# EAGLE schematic SparkFun_Artemis_OpenLog (EAGLE 9.6.0)
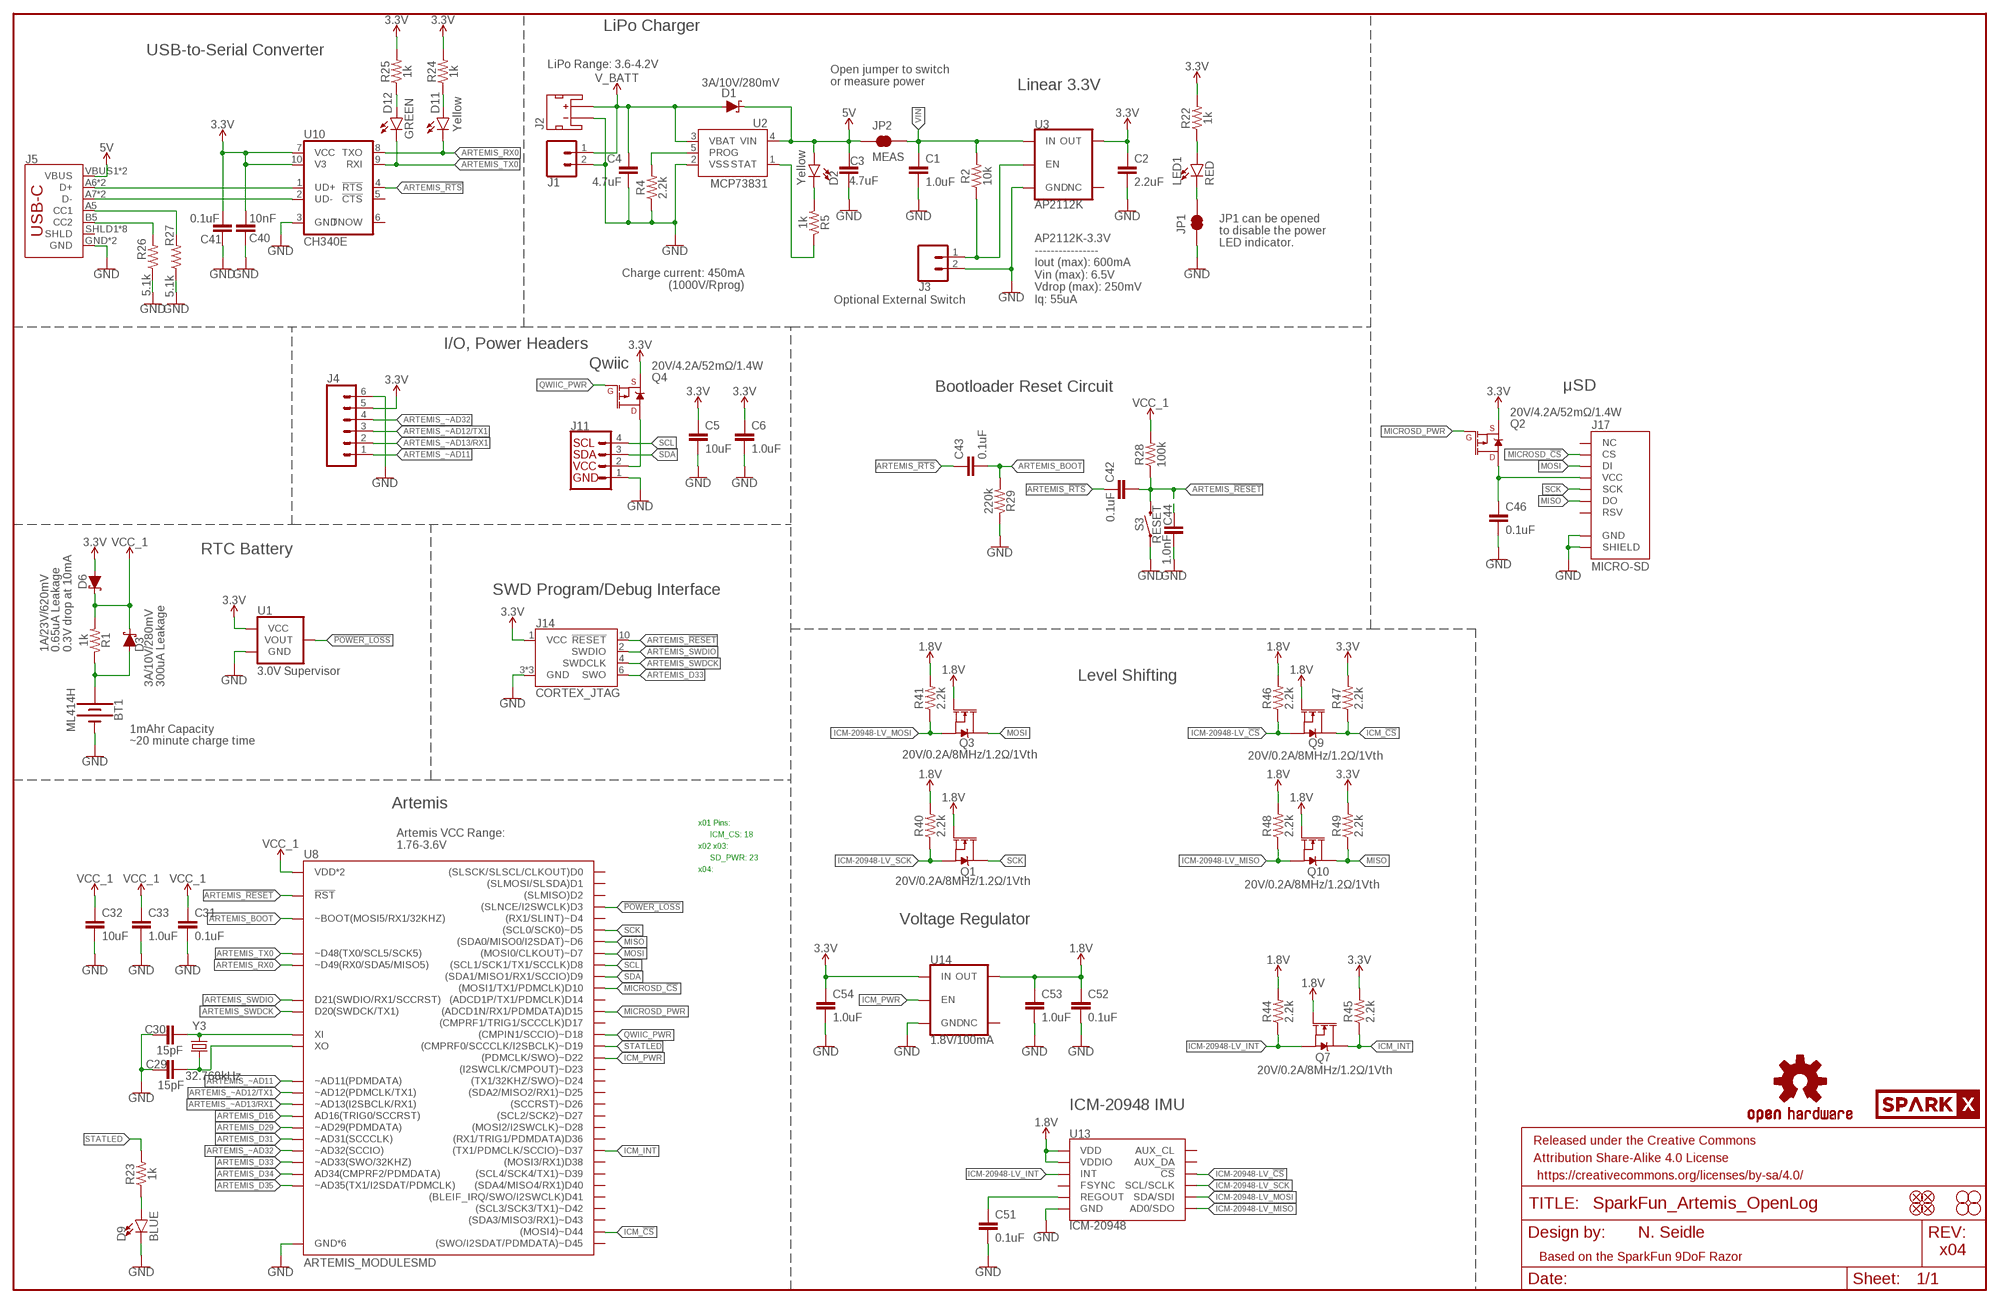
[diagram p0: schematic, sheet 1]

## Parts
BT1  ML414H  ML414H_IV01E_BATTERY  [ML414H_IV01E]
C1  1.0uF  1.0UF-0603-16V-10%  [0603]
C2  2.2uF  2.2UF-0603-10V-20%  [0603]
C3  4.7uF  4.7UF-0402_TIGHT-6.3V-20%-X5R  [0402-TIGHT]
C4  4.7uF  4.7UF-0402_TIGHT-6.3V-20%-X5R  [0402-TIGHT]
C5  10uF  10UF-0603-6.3V-20%  [0603]
C6  1.0uF  1.0UF-0402T-16V-10%  [0402-TIGHT]
C29  15pF  15PF-0402T-50V-5%  [0402-TIGHT]
C30  15pF  15PF-0402T-50V-5%  [0402-TIGHT]
C31  0.1uF  0.1UF-0402T-16V-10%  [0402-TIGHT]
C32  10uF  10UF-0603-6.3V-20%  [0603]
C33  1.0uF  1.0UF-0402T-16V-10%  [0402-TIGHT]
C40  10nF  10NF-0603-50V-10%  [0603]
C41  0.1uF  0.1UF-0402T-16V-10%  [0402-TIGHT]
C42  0.1uF  0.1UF-0402T-16V-10%  [0402-TIGHT]
C43  0.1uF  0.1UF-0402T-16V-10%  [0402-TIGHT]
C44  1.0nF  1.0NF/1000PF-0402_TIGHT-50V-10%  [0402-TIGHT]
C46  0.1uF  0.1UF-0402T-16V-10%  [0402-TIGHT]
C51  0.1uF  0.1UF-0402T-16V-10%  [0402-TIGHT]
C52  0.1uF  0.1UF-0402T-16V-10%  [0402-TIGHT]
C53  1.0uF  1.0UF-0402T-16V-10%  [0402-TIGHT]
C54  1.0uF  1.0UF-0402T-16V-10%  [0402-TIGHT]
D1  3A/10V/280mV  DIODE-SCHOTTKY-BAT60A  [SOD-323]
D2  Yellow  LED-YELLOW0603  [LED-0603]
D3  3A/10V/280mV  DIODE-SCHOTTKY-BAT60A  [SOD-323]
D6  1A/23V/620mV  DIODE-SCHOTTKY-BAT20J  [SOD-323]
D9  BLUE  LED-BLUE0603  [LED-0603]
D11  Yellow  LED-YELLOW0603  [LED-0603]
D12  GREEN  LED-GREEN0603  [LED-0603]
FD1  FIDUCIAL1X2  [FIDUCIAL-1X2]
FD2  FIDUCIAL1X2  [FIDUCIAL-1X2]
FD3  FIDUCIAL1X2  [FIDUCIAL-1X2]
FD4  FIDUCIAL1X2  [FIDUCIAL-1X2]
FRAME1  FRAME-LEDGER  [CREATIVE_COMMONS]
H1  STAND-OFF  [STAND-OFF]
H2  STAND-OFF  [STAND-OFF]
H3  STAND-OFF  [STAND-OFF]
H4  STAND-OFF  [STAND-OFF]
J1  CONN_021X02_NO_SILK  [1X02_NO_SILK]
J2  JST_2MM_MALE  [JST-2-SMD]
J3  CONN_021X02_NO_SILK  [1X02_NO_SILK]
J4  CONN_06NO_SILK_NO_POP  [1X06_NO_SILK]
J5  USB_C5  [USB-C-16P-5]
J11  QWIIC_CONNECTORJS-1MM  [JST04_1MM_RA]
J14  CORTEX_JTAG  CORTEX_JTAG_DEBUG_MINIMUM_PTH  [2X5-PTH-1.27MM]
J17  MICRO-SD  MICRO-SD_CARD_SOCKETPUSH-PUSH  [MICRO-SD-SOCKET]
JP1  JUMPER-SMT_2_NC_TRACE_SILK  [SMT-JUMPER_2_NC_TRACE_SILK]
JP2  MEAS  JUMPER-COMBO_2_NC_TRACE  [COMBO-JUMPER_2_NC_TRACE]
LED1  RED  LED-RED0603  [LED-0603]
LOGO2  OSHW-LOGOS  [OSHW-LOGO-S]
Q1  20V/0.2A/8MHz/1.2Ω/1Vth  MOSFET-NCH-RE1C00UNTL  [SOT-416FL]
Q2  20V/4.2A/52mΩ/1.4W  MOSFET_PCH-DMG2305UX-7  [SOT23-3]
Q3  20V/0.2A/8MHz/1.2Ω/1Vth  MOSFET-NCH-RE1C00UNTL  [SOT-416FL]
Q4  20V/4.2A/52mΩ/1.4W  MOSFET_PCH-DMG2305UX-7  [SOT23-3]
Q7  20V/0.2A/8MHz/1.2Ω/1Vth  MOSFET-NCH-RE1C00UNTL  [SOT-416FL]
Q9  20V/0.2A/8MHz/1.2Ω/1Vth  MOSFET-NCH-RE1C00UNTL  [SOT-416FL]
Q10  20V/0.2A/8MHz/1.2Ω/1Vth  MOSFET-NCH-RE1C00UNTL  [SOT-416FL]
R1  1k  1KOHM-0402T-1/16W-1%  [0402-TIGHT]
R2  10k  10KOHM-0402T-1/16W-1%  [0402-TIGHT]
R4  2.2k  2.2KOHM-0402T-1/16W-1%  [0402-TIGHT]
R5  1k  1KOHM-0402T-1/16W-1%  [0402-TIGHT]
R22  1k  1KOHM-0402T-1/16W-1%  [0402-TIGHT]
R23  1k  1KOHM-0402T-1/16W-1%  [0402-TIGHT]
R24  1k  1KOHM-0402T-1/16W-1%  [0402-TIGHT]
R25  1k  1KOHM-0402T-1/16W-1%  [0402-TIGHT]
R26  5.1k  5.1KOHM-0402T-1/16W-1%  [0402-TIGHT]
R27  5.1k  5.1KOHM-0402T-1/16W-1%  [0402-TIGHT]
R28  100k  100KOHM-0402T-1/16W-1%  [0402-TIGHT]
R29  220k  220KOHM-0603-1/10W-1%  [0603]
R40  2.2k  2.2KOHM-0402T-1/16W-1%  [0402-TIGHT]
R41  2.2k  2.2KOHM-0402T-1/16W-1%  [0402-TIGHT]
R44  2.2k  2.2KOHM-0402T-1/16W-1%  [0402-TIGHT]
R45  2.2k  2.2KOHM-0402T-1/16W-1%  [0402-TIGHT]
R46  2.2k  2.2KOHM-0402T-1/16W-1%  [0402-TIGHT]
R47  2.2k  2.2KOHM-0402T-1/16W-1%  [0402-TIGHT]
R48  2.2k  2.2KOHM-0402T-1/16W-1%  [0402-TIGHT]
R49  2.2k  2.2KOHM-0402T-1/16W-1%  [0402-TIGHT]
S3  RESET  MOMENTARY-SWITCH-SPST-SMD-4.6X2.8MM  [TACTILE_SWITCH_SMD_4.6X2.8MM]
U1  3.0V Supervisor  V_SUPERVISOR  [SOT23-3]
U2  MCP73831  [SOT23-5]
U3  AP2112K  V_REG_AP2112K-3.3V  [SOT23-5]
U8  ARTEMIS_MODULESMD  [ARTEMIS_FP]
U10  CH340E  CH340E_MSOP10  [MSOP10]
U13  ICM-20948  [QFN24-3X3]
U14  1.8V/100mA  V_REG_SP6214-1.8V  [SC70]
U$6  SPARKX-LOGO3  [SPARKX-SMALL]
Y3  32.768kHz  CRYSTAL-32.768KHZSMD-3.2X1.5  [CRYSTAL-SMD-3.2X1.5MM]

## Nets
3.3V: C2.1 C5.1 C6.1 C40.1 C41.1 C54.1 D6.A J4.5 J14.1(VCC) Q2.2(S) Q4.2(S) R22.2 R24.2 R25.2 R45.2 R47.2 R49.2 U1.3(VCC) U3.5(OUT) U10.7(VCC) U10.10(V3) U14.1(IN)
5V: C3.1 D1.C D2.A J5.VBUS1(VBUS) J5.VBUS2(VBUS) JP2.1 JP2.3 U2.4(VIN)
!POWER_LOSS!: U1.2(VOUT) U8.D3((SLNCE/I2SWCLK)D3)
ARTEMIS_!RESET: C42.2 C44.1 J14.10(!RESET) R28.1 S3.3 S3.4 U8.~RST(!RST)
ARTEMIS_!RTS!: C42.1 C43.1 U10.4(!RTS)
ARTEMIS_BOOT: C43.2 R29.2 U8.BOOT(~BOOT(MOSI5/RX1/32KHZ))
ARTEMIS_D16: U8.AD16(AD16(TRIG0/SCCRST))
ARTEMIS_D29: U8.~AD29(~AD29(PDMDATA))
ARTEMIS_D31: U8.~AD31(~AD31(SCCCLK))
ARTEMIS_D33: J14.6(SWO) U8.~AD33/SWO(~AD33(SWO/32KHZ))
ARTEMIS_D34: U8.AD34(AD34(CMPRF2/PDMDATA))
ARTEMIS_D35: U8.~AD35(~AD35(TX1/I2SDAT/PDMCLK))
ARTEMIS_RX0: D11.C U8.RXI-0(~D49(RX0/SDA5/MISO5)) U10.8(TXO)
ARTEMIS_SWDCK: J14.4(SWDCLK) U8.SWDCK(D20(SWDCK/TX1))
ARTEMIS_SWDIO: J14.2(SWDIO) U8.SWDIO(D21(SWDIO/RX1/SCCRST))
ARTEMIS_TX0: D12.C U8.TXO-0(~D48(TX0/SCL5/SCK5)) U10.9(RXI)
ARTEMIS_~AD11: J4.1 U8.~AD11(~AD11(PDMDATA))
ARTEMIS_~AD12/TX1: J4.3 U8.~AD12(~AD12(PDMCLK/TX1))
ARTEMIS_~AD13/RX1: J4.2 U8.~AD13(~AD13(I2SBCLK/RX1))
ARTEMIS_~AD32: J4.4 U8.~AD32(~AD32(SCCIO))
CC3: J5.B5(CC2) R26.2
CC4: J5.A5(CC1) R27.2
CHG_LED: R5.1 U2.1(STAT)
D+2: J5.A6(D+) J5.B6(D+) U10.1(UD+)
D-2: J5.A7(D-) J5.B7(D-) U10.2(UD-)
GND: BT1.- C1.2 C2.2 C3.2 C4.2 C5.2 C6.2 C29.1 C30.1 C31.1 C32.2 C33.2 C40.2 C41.2 C44.2 C46.2 C51.2 C52.2 C53.2 C54.2 D9.C J1.2 J2.1(-) J3.2 J4.6 J5.GND J5.GND2(GND) J11.1 J14.3(GND) J14.5(GND) J14.9(GND) J17.CD1(SHIELD) J17.GND JP1.1 R4.1 R26.1 R27.1 R29.1 S3.1 S3.2 U1.1(GND) U2.2(VSS) U3.2(GND) U8.GND@1(GND*6) U8.GND@22(GND*6) U8.GND@38(GND*6) U8.GND@39(GND*6) U8.GND@47(GND*6) U8.GND@59(GND*6) U10.3(GND) U13.18(GND) U13.20(GND) U14.2(GND)
ICM-20948-LV_!CS!: Q9.2(S) R46.1 U13.22(!CS)
ICM-20948-LV_#_1.8V: C52.1 C53.1 Q1.1(G) Q3.1(G) Q7.1(G) Q9.1(G) Q10.1(G) R40.2 R41.2 R44.2 R46.2 R48.2 U13.8(VDDIO) U13.13(VDD) U14.5(OUT) ; supply symbol labelled 1.8V
ICM-20948-LV_INT: Q7.2(S) R44.1 U13.12(INT)
ICM-20948-LV_MISO: Q10.2(S) R48.1 U13.9(AD0/SDO)
ICM-20948-LV_MOSI: Q3.2(S) R41.1 U13.24(SDA/SDI)
ICM-20948-LV_SCK: Q1.2(S) R40.1 U13.23(SCL/SCLK)
ICM_!CS!: Q9.3(D) R47.1 U8.~D44((MOSI4)~D44)
ICM_INT: Q7.3(D) R45.1 U8.~D37((TX1/PDMCLK/SCCIO)~D37)
ICM_PWR: U8.~D22((PDMCLK/SWO)~D22) U14.3(EN)
MICROSD_!CS!: J17.CS U8.D10((MOSI1/TX1/PDMCLK)D10)
MICROSD_PWR: Q2.1(G) U8.D15((ADCD1N/RX1/PDMDATA)D15)
MISO: J17.DO Q10.3(D) R49.1 U8.~D6((SDA0/MISO0/I2SDAT)~D6)
MOSI: J17.DI Q3.3(D) U8.D7((MOSI0/CLKOUT)~D7)
N$1: BT1.+ D3.A R1.1
N$4: JP1.2 LED1.C
N$5: J11.2 Q4.3(D)
N$7: R4.2 U2.5(PROG)
N$11: D2.C R5.2
N$20: C29.2 U8.XO Y3.P$2
N$21: C30.2 U8.XI Y3.P$1
N$24: LED1.A R22.1
N$25: D9.A R23.1
N$26: D12.A R25.1
N$27: D11.A R24.1
N$30: C51.1 U13.10(REGOUT)
QWIIC_PWR: Q4.1(G) U8.~D18((CMPIN1/SCCIO)~D18)
SCK: J17.SCLK(SCK) Q1.3(D) U8.~D5((SCL0/SCK0)~D5)
SCL: J11.4 U8.D8((SCL1/SCK1/TX1/SCCLK)D8)
SD_PWR: C46.1 J17.VCC Q2.3(D)
SDA: J11.3 U8.D9((SDA1/MISO1/RX1/SCCIO)D9)
STATLED: R23.2 U8.~D19((CMPRF0/SCCCLK/I2SBCLK)~D19)
V_BATT: C4.1 D1.A J1.1 J2.2(+) U2.3(VBAT)
VCC_1: C31.2 C32.1 C33.1 D3.C D6.C R1.2 R28.2 U8.VDD@36(VDD*2) U8.VDD@37(VDD*2)
VIN: C1.1 JP2.2 JP2.4 R2.2 U3.1(IN)
VREG_EN: J3.1 R2.1 U3.3(EN)
Unconnected: J2.NC1(PAD1) J2.NC2(PAD2) J5.SHLD1(SHLD) J5.SHLD2(SHLD) J5.SHLD3(SHLD) J5.SHLD4(SHLD) J5.SHLD5(SHLD) J5.SHLD6(SHLD) J5.SHLD7(SHLD) J5.SHLD8(SHLD) J17.RSV1(RSV) J17.RSV2(NC) U3.4(NC) U8.D0((SLSCK/SLSCL/CLKOUT)D0) U8.D1((SLMOSI/SLSDA)D1) U8.D2((SLMISO)D2) U8.D14((ADCD1P/TX1/PDMCLK)D14) U8.D17((CMPRF1/TRIG1/SCCCLK)D17) U8.D36((RX1/TRIG1/PDMDATA)D36) U8.D38((MOSI3/RX1)D38) U8.D40((SDA4/MISO4/RX1)D40) U8.D41((BLEIF_IRQ/SWO/I2SWCLK)D41) U8.~D4((RX1/SLINT)~D4) U8.~D23((I2SWCLK/CMPOUT)~D23) U8.~D24((TX1/32KHZ/SWO)~D24) U8.~D25((SDA2/MISO2/RX1)~D25) U8.~D26((SCCRST)~D26) U8.~D27((SCL2/SCK2)~D27) U8.~D28((MOSI2/I2SWCLK)~D28) U8.~D39((SCL4/SCK4/TX1)~D39) U8.~D42((SCL3/SCK3/TX1)~D42) U8.~D43((SDA3/MISO3/RX1)~D43) U8.~D45((SWO/I2SDAT/PDMDATA)~D45) U10.5(!CTS) U10.6(TNOW) U13.7(AUX_CL) U13.11(FSYNC) U13.21(AUX_DA) U14.4(NC)

## Notes on the sheet
- LiPo Charger
- USB-to-Serial Converter
- LiPo Range: 3.6-4.2V
- Linear 3.3V
- Open jumper to switch
  or measure power
- JP1 can be opened
  to disable the power
  LED indicator.
- AP2112K-3.3V
  ----------------
  Iout (max): 600mA 
  Vin (max): 6.5V
  Vdrop (max): 250mV
  Iq: 55uA
- Charge current: 450mA
  (1000V/Rprog)
- Optional External Switch
- I/O, Power Headers
- Qwiic
- Bootloader Reset Circuit | μSD
- RTC Battery
- SWD Program/Debug Interface
- 0.65uA Leakage
  0.3V drop at 10mA
- Level Shifting
- 300uA Leakage
- 1mAhr Capacity
- ~20 minute charge time
- Artemis
- x01 Pins:
- ICM_CS: 18
- Artemis VCC Range:
  1.76-3.6V
- x02 x03:
- SD_PWR: 23
- x04:
- Voltage Regulator
- ICM-20948 IMU
- N. Seidle
- x04
- Based on the SparkFun 9DoF Razor

## Library data of the parts
BT1 = SparkFun-Batteries:ML414H_IV01E_BATTERY: SEIKO ML414H-IV01E Reflowable Lithium Battery ML414H is a rechargeable, coin type battery with features such as Pb-free reflowable (Peak temperature: 260 C) and high temperature heat resistance. Battery Characteristics: 3.1V max voltage Voff is 2V 1mAH 3k series resistor with battery 72 hour charge time from 2.0-3.1V 2.3-2.8V initial charge; PROD_ID: BATT-14267
C1 = SparkFun-Capacitors:1.0UF: 1µF ceramic capacitors A capacitor is a passive two-terminal electrical component used to store electrical energy temporarily in an electric field.; PROD_ID: CAP-00868
C2 = SparkFun-Capacitors:2.2UF: 2.2µF ceramic capacitors A capacitor is a passive two-terminal electrical component used to store electrical energy temporarily in an electric field.; PROD_ID: CAP-07888
C3 C4 = SparkFun-Capacitors:4.7UF: 4.7µF ceramic capacitors A capacitor is a passive two-terminal electrical component used to store electrical energy temporarily in an electric field.; PROD_ID: CAP-14240
C5 C32 = SparkFun-Capacitors:10UF: 10.0µF ceramic capacitors A capacitor is a passive two-terminal electrical component used to store electrical energy temporarily in an electric field.; PROD_ID: CAP-11015
C6 C33 C53 C54 = SparkFun-Capacitors:1.0UF: 1µF ceramic capacitors A capacitor is a passive two-terminal electrical component used to store electrical energy temporarily in an electric field.; PROD_ID: CAP-12417
C29 C30 = SparkFun-Capacitors:15PF: 15pF ceramic capacitors A capacitor is a passive two-terminal electrical component used to store electrical energy temporarily in an electric field.; PROD_ID: CAP-13063
C31 C41-C43 C46 C51 C52 = SparkFun-Capacitors:0.1UF: 0.1µF ceramic capacitors A capacitor is a passive two-terminal electrical component used to store electrical energy temporarily in an electric field.; PROD_ID: CAP-12416
C40 = SparkFun-Capacitors:10NF: 0.01uF/10nF/10,000pF ceramic capacitors A capacitor is a passive two-terminal electrical component used to store electrical energy temporarily in an electric field. CAP-09321; PROD_ID: CAP-00867
C44 = SparkFun-Capacitors:1.0NF/1000PF: 1nF/1,000pF ceramic capacitors A capacitor is a passive two-terminal electrical component used to store electrical energy temporarily in an electric field.; PROD_ID: CAP-14280
D1 D3 = SparkFun-DiscreteSemi:DIODE-SCHOTTKY: Schottky diode A Schottky diode is a semiconductor diode which has a low forward voltage drop and a very fast switching action.; PROD_ID: DIO-14072
D2 D11 = SparkFun-LED:LED-YELLOW: Yellow SMD LED Used in manufacturing several products at SparkFun. Packages: 0603 - SMD 0603 package[Product Link] <http://www.kingbrightusa.com/product.asp?catalog_name=LED&product_id=APT1608SYCK> 0603 -SMART - SMART SMD 0603 package (more efficient/more expensive) [Product Link] <http://www.osram-os.com/osram_os/en/products/product-catalog/led-light-emitting-diodes/smartled-0603/ly-l29k/index.jsp> LilyPad - SMD1206 package[Product Datasheet] <https://www.sparkfun.com/datasheets/DevTools/LilyPad/Q150YUS4.pdf> SparkFun Products: Blynk Board <https://www.sparkfun.com/products/13794> IOIO-OTG <https://www.sparkfun.com/products/13613> XBee Explorer Serial <https://www.sparkfun.com/products/13225>; PROD_ID: DIO-09003
D6 = SparkFun-DiscreteSemi:DIODE-SCHOTTKY: Schottky diode A Schottky diode is a semiconductor diode which has a low forward voltage drop and a very fast switching action.; PROD_ID: DIO-11623
D9 = SparkFun-LED:LED-BLUE: Blue SMD LED Used in manufacturing of various products at SparkFun Packages: 0603 - SMD 0603 package [Product Link] <http://www.digikey.com/product-detail/en/SMLE12BC7TT86/511-1589-2-ND/1641808> 1206 - SMD1206 package [Product Link] <http://www.digikey.com/product-detail/en/lite-on-inc/LTST-C150TBKT/160-1643-1-ND/573584> SparkFun Products: ESP8266 Thing-Dev Board <https://www.sparkfun.com/products/13711> RedBoard <https://www.sparkfun.com/products/12757>; PROD_ID: DIO-08575
D12 = SparkFun-LED:LED-GREEN: Green SMD LED Used in manufacturing of various products at SparkFun Packages: 0603 - SMD 0603 package [Product Link] <http://www.futureelectronics.com/en/technologies/semiconductors/optoelectronics/leds/Pages/9894312-LTST-C190GKT.aspx?CrossPart=HSMG-C190&IM=0> LilyPad 1206 - SMD1206 LilyPad package [Product Link] <http://www.futureelectronics.com/en/Technologies/Product.aspx?ProductID=IN150NGHARVATEKCORPORATION2049943&IM=0> 1206 - SMD1206 package [Product Link] <http://www.futureelectronics.com/en/technologies/semiconductors/optoelectronics/leds/Pages/8315665-LTST-C150KGKT.aspx?IM=0> 1206 Bottom Mount -SMD 1206 Bottom Mount [Product Link] <http://www.digikey.com/product-detail/en/lite-on-inc/LTST-C230KGKT/160-1456-1-ND/386854> SparkFun Products: Pro Mini 328 -5V <https://www.sparkfun.com/products/821> RedBoard <https://www.sparkfun.com/products/12757> MP3 Trigger <https://www.sparkfun.com/products/13720> Makey Makey <https://www.sparkfun.com/products/11076>; PROD_ID: DIO-00821
FD1-FD4 = SparkFun-Aesthetics:FIDUCIAL: Fiducial Alignment Points Point-of-reference for pick-and-place machines and other optical instruments.
FRAME1 = SparkFun-Aesthetics:FRAME-LEDGER: Schematic Frame - Ledger Standard 11x14 US Ledger frame
H1-H4 = SparkFun-Hardware:STAND-OFF: Stand Off Drill holes for mechanically mounting via screws, standoffs, etc. Note: Use the keepout ring to avoid running the screw head into surrounding components. Variant Overviews STAND-OFF - Mechanical footprint for a #4 phillips button head screw. STAND-OFF-TIGHT - Mechanical footprint for a #4 phillips button head screw, Example SparkFun Products Screw - Phillips Head (1/4", 4-40, 10 pack) <https://www.sparkfun.com/products/10453> (PRT-10453) Screw - Phillips Head (1/2", 4-40, 10 pack) <https://www.sparkfun.com/products/10452> (PRT-10452) Screw - Phillips Head (3/4", 4-40, 10 pack) <https://www.sparkfun.com/products/10451> (PRT-10451) Screw - Phillips Head (1", 4-40, 10 pack) <https://www.sparkfun.com/products/10450> (PRT-10450)
J1 J3 = SparkFun-Connectors:CONN_02: Multi connection point. Often used as Generic Header-pin footprint for 0.1 inch spaced/style header connections On any of the 0.1 inch spaced packages, you can populate with these: Break Away Headers - Straight <https://www.sparkfun.com/products/116> (PRT-00116) Break Away Male Headers - Right Angle <https://www.sparkfun.com/products/553> (PRT-00553) Female Headers <https://www.sparkfun.com/products/115> (PRT-00115) Break Away Headers - Machine Pin <https://www.sparkfun.com/products/117> (PRT-00117) Break Away Female Headers - Swiss Machine Pin <https://www.sparkfun.com/products/743> (PRT-00743) For SCREWTERMINALS and SPRING TERMINALS visit here: Screw Terimnals on SparkFun.com <https://www.sparkfun.com/search/results?term=Screw+Terminals> (5mm/3.5mm/2.54mm spacing) This device is also useful as a general connection point to wire up your design to another part of your project. Our various solder wires solder well into these plated through hole pads. Hook-Up Wire - Assortment (Stranded, 22 AWG) <https://www.sparkfun.com/products/11375> (PRT-11375) Hook-Up Wire - Assortment (Solid Core, 22 AWG) <https://www.sparkfun.com/products/11367> (PRT-11367) View the entire wire category on our website here <https://www.sparkfun.com/categories/141> Special notes: Molex polarized connector foot print use with: PRT-08233 with associated crimp pins and housings. 2.54_SCREWTERM for use with PRT-10571. 3.5mm Screw Terminal footprints for PRT-08084 5mm Screw Terminal footprints for use with PRT-08432
J2 = SparkFun-Connectors:JST_2MM_MALE: JST 2MM MALE RA CONNECTOR Two pin, compact surface mount connector. Commonly used as a battery input connection point. We really like the solid locking feeling and high current rating on these small connectors. We use these all the time as battery connectors. Mates to single-cell LiPo batteries. Here is the connector we sell at SparkFun: JST Right Angle Connector - White <https://www.sparkfun.com/products/8612> (PRT-08612) Datasheet <http://www.sparkfun.com/datasheets/Prototyping/Connectors/JST-Horizontal.pdf> It was used on these SparkFun products: SparkFun MOSFET Power Controller <https://www.sparkfun.com/products/11214> (PRT-11214) SparkFun Battery Babysitter - LiPo Battery Manager <https://www.sparkfun.com/products/13777> (PRT-13777) And many, many others that required a lipo battery connection.; PROD_ID: CONN-11443; SF_ID: PRT-08612
J4 = SparkFun-Connectors:CONN_06: Multi connection point. Often used as Generic Header-pin footprint for 0.1 inch spaced/style header connections On any of the 0.1 inch spaced packages, you can populate with these: Break Away Headers - Straight <https://www.sparkfun.com/products/116> (PRT-00116) Break Away Male Headers - Right Angle <https://www.sparkfun.com/products/553> (PRT-00553) Female Headers <https://www.sparkfun.com/products/115> (PRT-00115) Break Away Headers - Machine Pin <https://www.sparkfun.com/products/117> (PRT-00117) Break Away Female Headers - Swiss Machine Pin <https://www.sparkfun.com/products/743> (PRT-00743) Arduino Stackable Header - 6 Pin <https://www.sparkfun.com/products/9280> (PRT-09280) For SCREWTERMINALS and SPRING TERMINALS visit here: Screw Terimnals on SparkFun.com <https://www.sparkfun.com/search/results?term=Screw+Terminals> (5mm/3.5mm/2.54mm spacing) This device is also useful as a general connection point to wire up your design to another part of your project. Our various solder wires solder well into these plated through hole pads. Hook-Up Wire - Assortment (Stranded, 22 AWG) <https://www.sparkfun.com/products/11375> (PRT-11375) Hook-Up Wire - Assortment (Solid Core, 22 AWG) <https://www.sparkfun.com/products/11367> (PRT-11367) View the entire wire category on our website here <https://www.sparkfun.com/categories/141>
J5 = USBC:USB_C: USB Type C 16Pin Connector Super Speed pins not available on the 16-pin purely SMD connector so this part is best for USB 2.0 implementations. D1 and D2 are tied together enabling D+/- no matter which way the cable is plugged into the connector. The two channel configuration pins (CC1/2) are exposed. These are normally connected to ground via 5.1k resistors but can be reconfigured for high current/high power applications.
J11 = SparkFun-Connectors:QWIIC_CONNECTOR: SparkFun I2C Standard Qwiic Connector An SMD 1mm pitch JST connector makes it easy and quick (get it? Qwiic?) to connect I2C devices to each other. The Qwiic system <http://www.sparkfun.com/qwiic> enables fast and solderless connection between popular platforms and various sensors and actuators. We carry 200mm <https://www.sparkfun.com/products/14204>, 100mm <https://www.sparkfun.com/products/14205>, 50mm <https://www.sparkfun.com/products/14206>, and breadboard friendly <https://www.sparkfun.com/products/14207> Qwiic cables. We also offer 10 pcs strips <https://www.sparkfun.com/products/14323> the SMD connectors.; PROD_ID: CONN-13694; VALUE: QWIIC_RIGHT_ANGLE
J14 = SparkFun-Connectors:CORTEX_JTAG_DEBUG_MINIMUM: Cortex Debug Connector - 10 pin Supports JTAG debug, Serial Wire debug, and Serial Wire Viewer. PTH and SMD connector options available. General Connector Information <http://infocenter.arm.com/help/topic/com.arm.doc.faqs/attached/13634/cortex_debug_connectors.pdf> Products: PTH Connector <http://www.digikey.com/product-detail/en/cnc-tech/3220-10-0100-00/1175-1627-ND/3883661> -via Digi-Key SparkFun PSoc <https://www.sparkfun.com/products/13229> SparkFun T <https://www.sparkfun.com/products/13810>
J17 = SparkFun-Connectors:MICRO-SD_CARD_SOCKET: microSD Socket for Transflash Push-push type µSD socket. tDoc lines correctly indicate media card edge positions when inserting (unlocked, locked, depressed). NOTE: CD1 and CD2 are connected internally, and the default detect state of the socket is detect pin to ground. SparkFun Products: WAV Trigger <https://www.sparkfun.com/products/13660> CAN-Bus Shield <https://www.sparkfun.com/products/13262> SparkFun Level Shifing microSD Breakout <https://www.sparkfun.com/products/13743>; PROD_ID: CONN-07820
JP1 = SparkFun-Jumpers:JUMPER-SMT_2_NC_TRACE: Normally closed trace jumper This jumper has a trace between two pads so it's normally closed (NC). Use a razor knife to open the connection. For best results follow the IPC guidelines for cutting traces: Cutout at least 0.063 mm (0.005 in). Remove all loose material to clean up the cut area. Seal the cut with an approved epoxy. Reapply solder to reclose the connection.
JP2 = SparkFun-Jumpers:JUMPER-COMBO_2_NC_TRACE
LED1 = SparkFun-LED:LED-RED: Red SMD LED Used in manufacturing of most products at SparkFun Packages: 0603 - SMD 0603 package [Product Link] <http://docs.avagotech.com/docs/AV02-0551EN> 0603 SMART - SMD 0603 SMART package ( more efficient and expensive)[Product Link] <http://www.osram-os.com/Graphics/XPic2/00077099_0.pdf> 1206 - SMD1206 package [Product Link] <https://www.sparkfun.com/datasheets/DevTools/LilyPad/Q150OVS4.pdff> SparkFun Products: Pro Mini 328 -5V <https://www.sparkfun.com/products/821> RedBoard <https://www.sparkfun.com/products/12757> IOIO-OTG <https://www.sparkfun.com/products/13613>; PROD_ID: DIO-00819
LOGO2 = SparkFun-Aesthetics:OSHW-LOGO: Open-Source Hardware (OSHW) Logo This logo indicates the piece of hardware it is found on incorporates a OSHW license and/or adheres to the definition of open source hardware found here: http://freedomdefined.org/OSHW
Q1 Q3 Q7 Q9 Q10 = SparkFun-DiscreteSemi:MOSFET-NCH: N-channel MOSFETs Voltage controlled devices that allow control of high current outputs. SparkFun Products: SparkFun OpenScale <https://www.sparkfun.com/products/13261> SparkFun Digital Sandbox <https://www.sparkfun.com/products/12651> SparkFun Monster Moto Shield <https://www.sparkfun.com/products/10182> SparkFun MOSFET Power Controller <https://www.sparkfun.com/products/11214>; PROD_ID: TRANS-14399
Q2 Q4 = SparkFun-DiscreteSemi:MOSFET_PCH: P-channel MOSFETs Voltage controlled devices that allow control of high current outputs. SparkFun Products: SparkFun ESP32 Thing <https://www.sparkfun.com/products/13907> SparkFun ESP8266 Thing <https://www.sparkfun.com/products/13231> SparkFun Pi Servo HAT V2 <https://www.sparkfun.com/products/15316> DMG2305UX-7 (20V/4.2A/SOT23-3); PROD_ID: TRAN-14388
R1 R5 R22-R25 = SparkFun-Resistors:1KOHM: 1kΩ resistor A resistor is a passive two-terminal electrical component that implements electrical resistance as a circuit element. Resistors act to reduce current flow, and, at the same time, act to lower voltage levels within circuits. - Wikipedia; PROD_ID: RES-14342
R2 = SparkFun-Resistors:10KOHM: 10kΩ resistor A resistor is a passive two-terminal electrical component that implements electrical resistance as a circuit element. Resistors act to reduce current flow, and, at the same time, act to lower voltage levels within circuits. - Wikipedia; PROD_ID: RES-14241
R4 R40 R41 R44-R49 = SparkFun-Resistors:2.2KOHM: 2.2kΩ resistor A resistor is a passive two-terminal electrical component that implements electrical resistance as a circuit element. Resistors act to reduce current flow, and, at the same time, act to lower voltage levels within circuits. - Wikipedia; PROD_ID: RES-14341
R26 R27 = SparkFun-Resistors:5.1KOHM; PROD_ID: RES-14340
R28 = SparkFun-Resistors:100KOHM: 100kΩ resistor A resistor is a passive two-terminal electrical component that implements electrical resistance as a circuit element. Resistors act to reduce current flow, and, at the same time, act to lower voltage levels within circuits. - Wikipedia; PROD_ID: RES-13495
R29 = SparkFun-Resistors:220KOHM: 220kΩ resistor A resistor is a passive two-terminal electrical component that implements electrical resistance as a circuit element. Resistors act to reduce current flow, and, at the same time, act to lower voltage levels within circuits. - Wikipedia; PROD_ID: RES-08969
S3 = SparkFun-Switches:MOMENTARY-SWITCH-SPST: Momentary Switch (Pushbutton) - SPST Normally-open (NO) SPST momentary switches (buttons, pushbuttons). Variants PTH-12MM - 12mm square, through-hole Momentary Pushbutton Switch - 12mm Square <https://www.sparkfun.com/products/9190> (COM-09190) PTH-6.0MM, PTH-6.0MM-KIT - 6.0mm square, through-hole Mini Pushbutton Switch <https://www.sparkfun.com/products/97> (COM-00097) KIT package intended for soldering kit's - only one side of pads' copper is exposed. PTH-RIGHT-ANGLE-KIT - Right-angle, through-hole Right Angle Tactile Button <https://www.sparkfun.com/products/10791> - Used on SparkFun BigTime Watch Kit <https://www.sparkfun.com/products/11734> SMD-12MM - 12mm square, surface-mount Tactile Button - SMD (12mm) <https://www.sparkfun.com/products/12993> (COM-12993) Used on SparkFun PicoBoard <https://www.sparkfun.com/products/11888> SMD-4.5MM - 4.5mm Square Trackball Switch Used on SparkFun Blackberry Trackballer Breakout <https://www.sparkfun.com/products/13169> SMD-4.6MMX2.8MM - 4.60mm x 2.80mm, surface mount Used on SparkFun SAMD21 Mini Breakout <https://www.sparkfun.com/products/13664> SMD-5.2MM, SMD-5.2-REDUNDANT - 5.2mm square, surface-mount Mini Pushbutton Switch - SMD <https://www.sparkfun.com/products/8720> (COM-08720) Used on Arduino Pro Mini <https://www.sparkfun.com/products/11114> REDUNDANT package connects both switch circuits together SMD-6.0X3.5MM - 6.0 x 3.5mm, surface mount Momentary Reset Switch SMD <https://www.sparkfun.com/products/8229> (COM-08229) SMD-6.2MM-TALL - 6.2mm square, surface mount Tactile Button - SMD (6mm) <https://www.sparkfun.com/products/12992> Used on SparkFun Digital Sandbox <https://www.sparkfun.com/products/12651> SMD-RIGHT-ANGLE - Right-angle, surface mount Used on SparkFun Block for Intel® Edison - Arduino <https://www.sparkfun.com/products/13036>; PROD_ID: SWCH-13065
U1 = SparkFun-IC-Power:V_SUPERVISOR: BD48xxx - Voltage Detector IC ROHM’s BD48xxx and BD49xxx series are highly accurate, low-current Voltage Detector IC series. The family includes BD48xxx devices with N-channel open drain output and BD49xxx devices with CMOS output. The devices are available for specific detection voltages ranging from 2.3V to 6.0V in increments of 0.1V.; PROD_ID: IC-14809
U2 = SparkFun-IC-Power:MCP73831: MCP73831T Li-Ion, Li-Pol Controller Miniature single cell, fully integrated Li-Ion, Li-polymer charge management controller Datasheet <http://ww1.microchip.com/downloads/en/DeviceDoc/20001984g.pdf> SparkFun Products: SparkFun ESP32 Thing <https://www.sparkfun.com/products/13907> SparkFun 9DoF Razor IMU M0 <https://www.sparkfun.com/products/14001>; PROD_ID: IC-09995
U3 = SparkFun-IC-Power:V_REG_AP2112: AP2112 - 600mA CMOS LDO Regulator w/ Enable The AP2112 is CMOS process low dropout linear regulator with enable function, the regulator delivers a guaranteed 600mA (min.) continuous load current. Features Output Voltage Accuracy: ±1.5% Output Current: 600mA (Min.) Foldback Short Current Protection: 50mA Enable Function to Turn ON/OFF VOUT Low Dropout Voltage (3.3V): 250mV (Typ.) @IOUT=600mA Excellent Load Regulation: 0.2%/A (Typ.) Excellent Line Regulation: 0.02%/V (Typ.) Low Quiescent Current: 55μA (Typ.) Low Standby Current: 0.01μA (Typ.) Low Output Noise: 50μVRMS PSRR: 100Hz -65dB, 1kHz -65dB OTSD Protection Stable with 1.0μF Flexible Cap: Ceramic, Tantalum and Aluminum Electrolytic Operation Temperature Range: -40°C to 85°C ESD: MM 400V, HBM 4000V; PROD_ID: VREG-12457; VALUE: 3.3V
U8 = SparkFun-IC-Microcontroller:ARTEMIS_MODULE: Description: The Artemis Module from SparkFun is a Cortex-M4F with BLE 5.0 running up to 96MHz and with as low power as 6uA per MHz (less than 5mW). This is the world's first module to bridge the market between hobbyists and consumer products. We've packaged all the power of a modern microcontroller into a module that is both extremely easy to use but is mass-market ready. The flexibility of the Artemis module starts with our [Arduino core](https://github.com/sparkfun/Arduino_Apollo3). You can program and use the Artemis module just like you would an Uno or any other Arduino. Time to first blink is just 5 minutes away! We built the core from the ground up, making it fast and as light weight as possible.; PROD_ID: SUB-14402
U10 = SparkFun-IC-Comms:CH340E; PROD_ID: IC-14135
U13 = SparkFun-Sensors:ICM-20948: ICM-20948 9 Degree of Freedom IMU World’s lowest power 9-axis MotionTracking device that is ideally suited for smartphones, tablets, wearable sensors, and IoT applications. Includes onboard Digital Motion Processor to offload computations from the host processor Datasheet <https://cdn.sparkfun.com/assets/learn_tutorials/5/5/0/MPU9250REV1.0.pdf> SparkFun Products: SparkFun IMU Breakout - ICM-20948 <https://www.sparkfun.com/products/15182>; PROD_ID: IC-14247; VALUE: 9DoF IMU
U14 = SparkFun-IC-Power:V_REG_SP6214: Voltage Regulator - SP6214 SP6214 Series SC-70-5 Micropower SC-70 100 mA CMOS LDO Regulator Datasheet <https://www.exar.com/content/document.ashx?id=654> SparkFun Products: MP3 Trigger <https://www.sparkfun.com/products/13720> SparkFun Particle Sensor Breakout <https://www.sparkfun.com/products/14045>; PROD_ID: VREG-08428
U$6 = SparkX:SPARKX-LOGO
Y3 = SparkFun-Clocks:CRYSTAL-32.768KHZ: 32.768kHz Crystal Frequency: 32.768kHz Frequency Stability: ±20ppm Load Capacitance: 12.5pF (PTH-2X6 & SMD-3.2X1.5), 6pF (SMD-2X6) SparkFun Products: SparkFun BigTime Watch Kit <https://www.sparkfun.com/products/11734> SparkFun nRF52832 Breakout <https://www.sparkfun.com/products/13990> SparkFun Real Time Clock Module <https://www.sparkfun.com/products/12708>; PROD_ID: XTAL-13062